# Altium project dmx_duino.PrjPcb
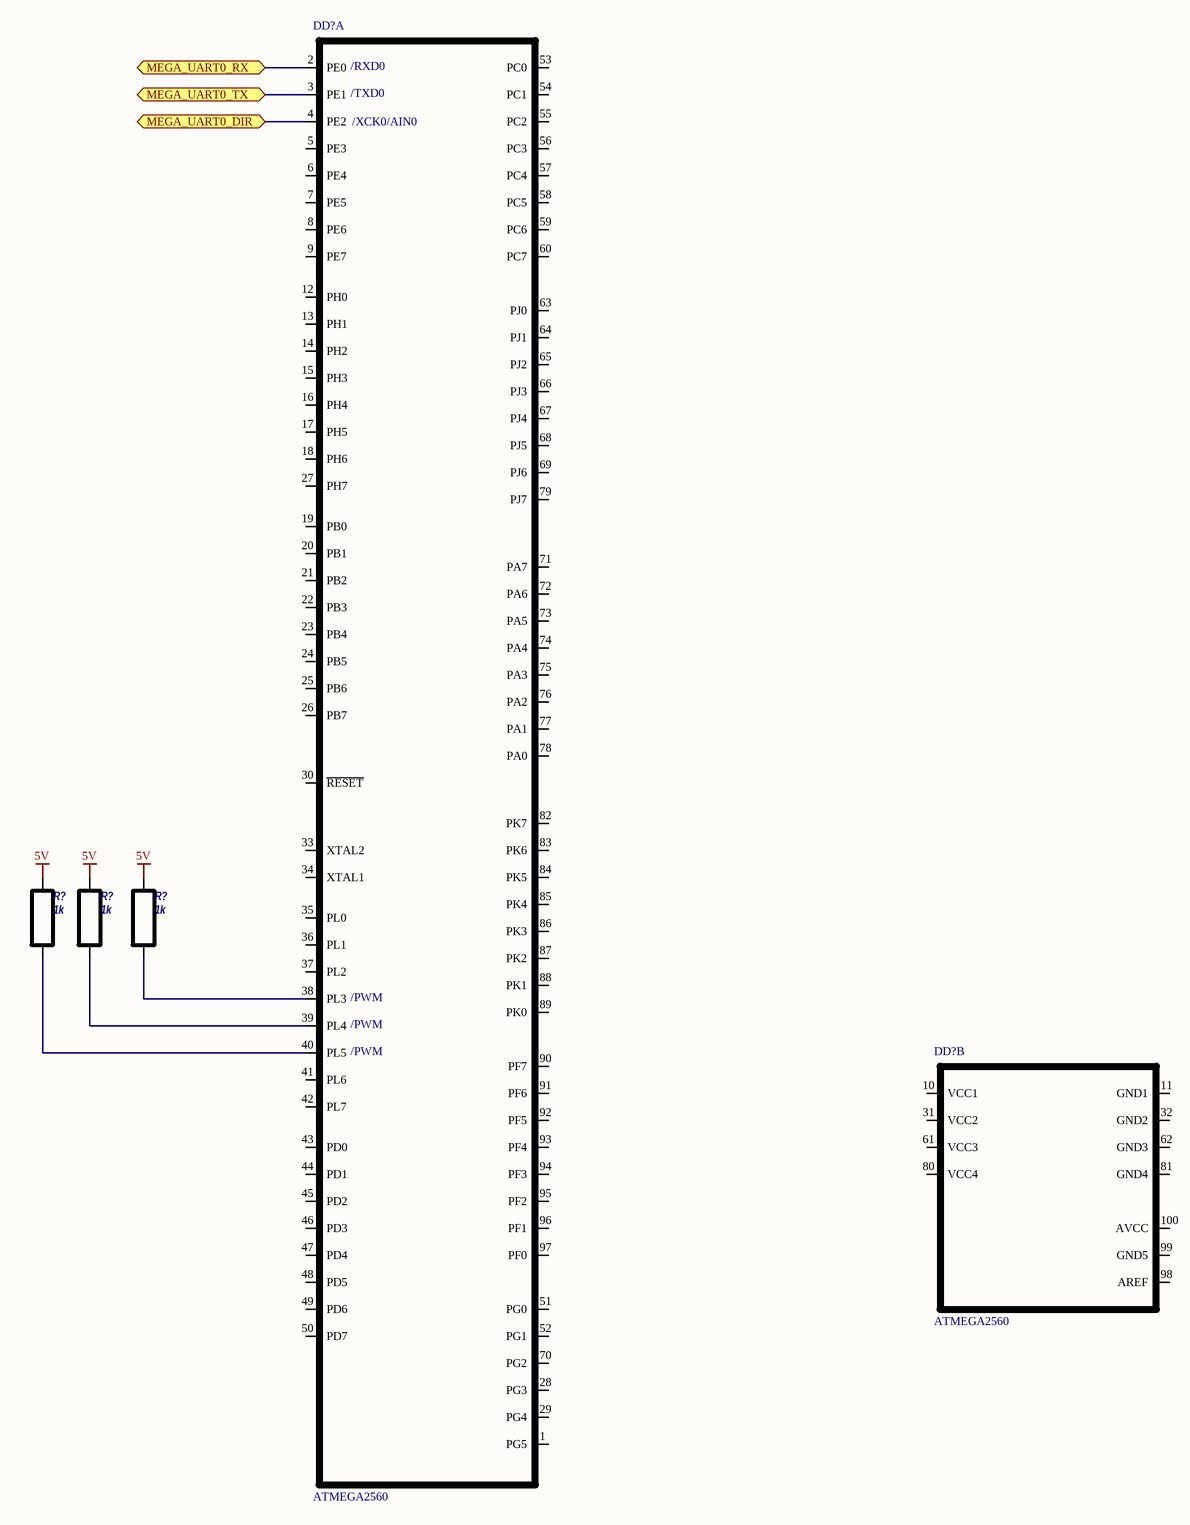
[diagram p0: atmega2560.SchDoc]
7 sheets, 112 parts. Net scope: hierarchical (ports join the sheet entries above them; power ports are global).
Sheets:
  atmega2560.SchDoc
  dmx_interface.SchDoc
  dmx_duino.SchDoc
    U_power = power.SchDoc
    U_STM32F105RBT6 = STM32F105RBT6.SchDoc
  PWM_outputs.SchDoc
  wh1602_buttons_and_encoder.SchDoc

## Sheet atmega2560.SchDoc
size A2

### Parts
(Parts that share a designator on the sheet are numbered #1, #2 ... from top to bottom, then left to right.)
DD?#1  ATMEGA2560  [TQFP100]  (part A of 2)
DD?#2  ATMEGA2560  [TQFP100]  (part B of 2)
R?#1  1k  [R0805]
R?#2  1k  [R0805]
R?#3  1k  [R0805]

### Ports
MEGA_UART0_DIR, MEGA_UART0_RX, MEGA_UART0_TX

### Nets
5V: R?#1.2 R?#2.2 R?#3.2
NetDD?#1_2: DD?#1.2(PE0) ; port MEGA_UART0_RX
NetDD?#1_3: DD?#1.3(PE1) ; port MEGA_UART0_TX
NetDD?#1_4: DD?#1.4(PE2) ; port MEGA_UART0_DIR
NetDD?#1_38: DD?#1.38(PL3) R?#3.1
NetDD?#1_39: DD?#1.39(PL4) R?#2.1
NetDD?#1_40: DD?#1.40(PL5) R?#1.1

Not connected (* = marked no-connect by the designer): DD?#1 1(PG5) 5(PE3) 6(PE4) 7(PE5) 8(PE6) 9(PE7) 12(PH0) 13(PH1) 14(PH2) 15(PH3) 16(PH4) 17(PH5) 18(PH6) 19(PB0) 20(PB1) 21(PB2) 22(PB3) 23(PB4) 24(PB5) 25(PB6) 26(PB7) 27(PH7) 28(PG3) 29(PG4) 30(~{RESET}) 33(XTAL2) 34(XTAL1) 35(PL0) 36(PL1) 37(PL2) 41(PL6) 42(PL7) 43(PD0) 44(PD1) 45(PD2) 46(PD3) 47(PD4) 48(PD5) 49(PD6) 50(PD7) 51(PG0) 52(PG1) 53(PC0) 54(PC1) 55(PC2) 56(PC3) 57(PC4) 58(PC5) 59(PC6) 60(PC7) 63(PJ0) 64(PJ1) 65(PJ2) 66(PJ3) 67(PJ4) 68(PJ5) 69(PJ6) 70(PG2) 71(PA7) 72(PA6) 73(PA5) 74(PA4) 75(PA3) 76(PA2) 77(PA1) 78(PA0) 79(PJ7) 82(PK7) 83(PK6) 84(PK5) 85(PK4) 86(PK3) 87(PK2) 88(PK1) 89(PK0) 90(PF7) 91(PF6) 92(PF5) 93(PF4) 94(PF3) 95(PF2) 96(PF1) 97(PF0); DD?#2 10(VCC1) 11(GND1) 31(VCC2) 32(GND2) 61(VCC3) 62(GND3) 80(VCC4) 81(GND4) 98(AREF) 99(GND5) 100(AVCC)

### Notes on the sheet
- (near DD?#1) /TXD0
- (near DD?#1) /RXD0
- (near DD?#1) /XCK0/AIN0
- (near DD?#1) /PWM

### Library data of the parts
DD?#1 DD?#2 = ATMEGA2560: Atmega2560 - TQFP100; Velue: *
R?#1-R?#3 = R: SMD resistor; Value: 1k

## Sheet dmx_interface.SchDoc
size A3
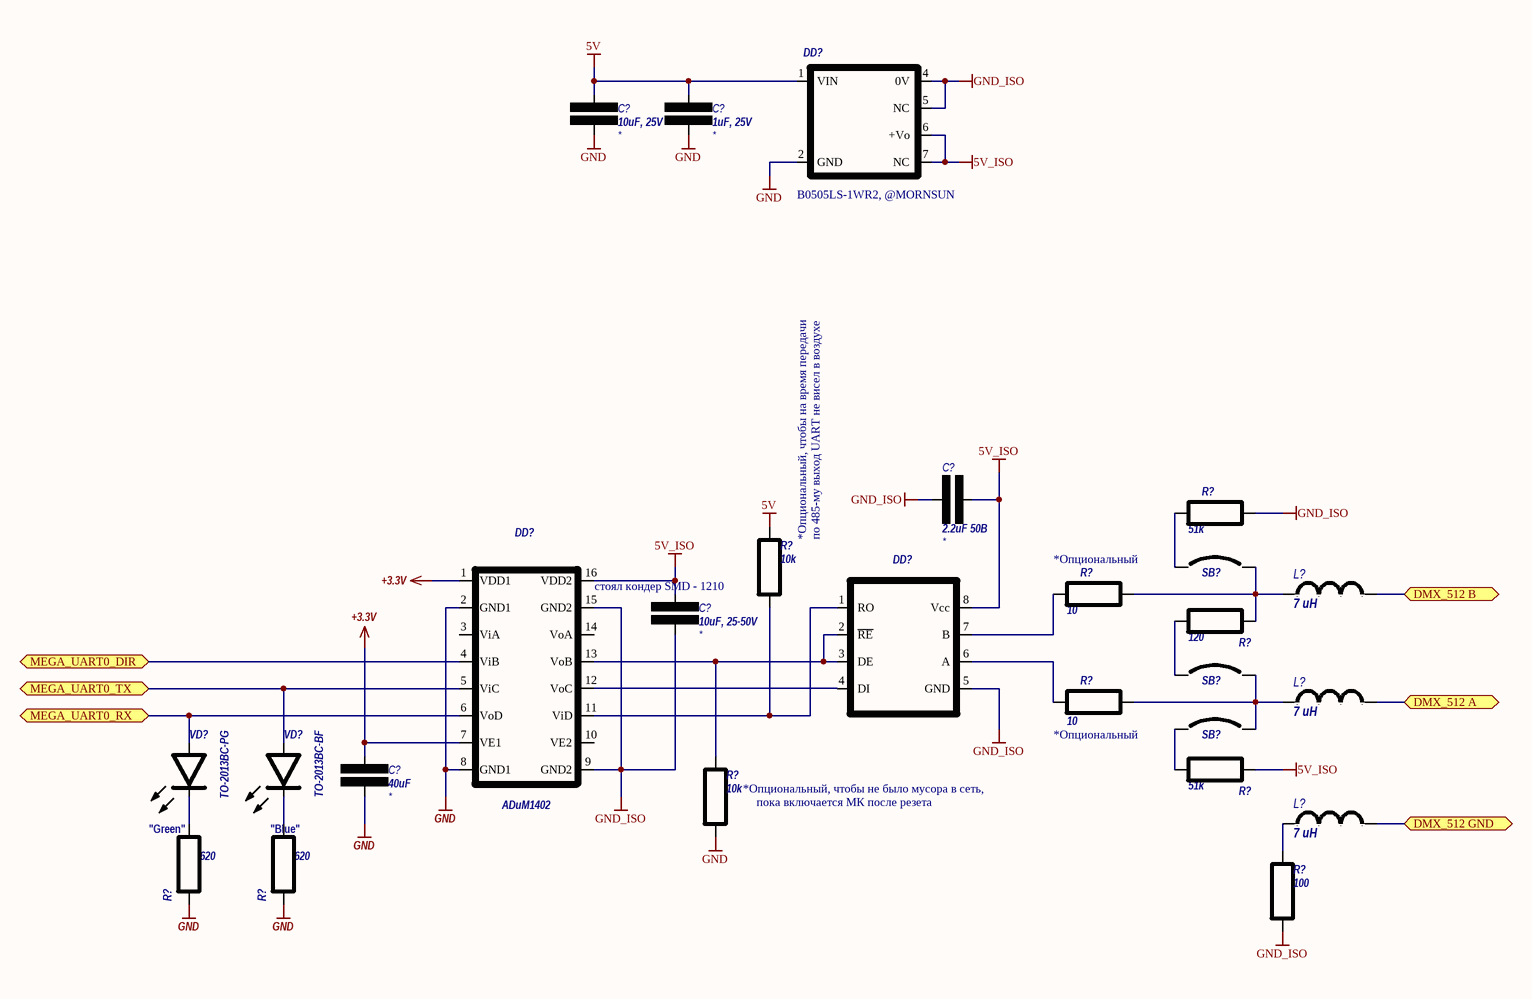
[diagram p1: dmx_interface.SchDoc]

### Parts
(Parts that share a designator on the sheet are numbered #1, #2 ... from top to bottom, then left to right.)
C?#1  10uF, 25V  [C1210]
C?#2  1uF, 25V  [C0805]
C?#3  2.2uF 50В  [C0805]
C?#4  10uF, 25-50V  [C1210]
C?#5  40uF  [C0805]
DD?#3  type: B0505LS-1WR2, @MORNSUN  [0505LS-ISO_POWER]  (hidden comment: B0505LS)
DD?#4  ADuM1402  [SOIC-16W]
DD?#5  ADM485  [DIP8_SMD]  (value not drawn)
L?#1  7 uH  [R0603]
L?#2  7 uH  [R0603]
L?#3  7 uH  [R0603]
R?#4  51k  [R0603]
R?#5  10k  [R0603]
R?#6  10  [R0603]
R?#7  120  [R0603]
R?#8  10  [R0603]
R?#9  51k  [R0603]
R?#10  10k  [R0603]
R?#11  100  [R0603]
R?#12  620  [R0805]
R?#13  620  [R0805]
SB?#1  SB  [SB0603]  (value not drawn)
SB?#2  SB  [SB0603]  (value not drawn)
SB?#3  SB  [SB0603]  (value not drawn)
VD?#1  value TO-2013BC-PG  [led0805]  (hidden comment: LED_0805)
VD?#2  value TO-2013BC-BF  [led0805]  (hidden comment: LED_0805)

### Ports
DMX_512 A, DMX_512 B, DMX_512 GND, MEGA_UART0_DIR, MEGA_UART0_RX, MEGA_UART0_TX

### Nets
5V: C?#1.2 C?#2.2 DD?#3.1(VIN) R?#5.1
5V_ISO: C?#3.2 C?#4.2 DD?#3.6(+Vo) DD?#3.7(NC) DD?#4.16(VDD2) DD?#5.8(Vcc) R?#9.1
+3.3V: C?#5.2 DD?#4.1(VDD1) DD?#4.7(VE1)
GND: C?#1.1 C?#2.1 C?#5.1 DD?#3.2(GND) DD?#4.2(GND1) DD?#4.8(GND1) R?#10.2 R?#12.1 R?#13.1
GND_ISO: C?#3.1 C?#4.1 DD?#3.4(0V) DD?#3.5(NC) DD?#4.9(GND2) DD?#4.15(GND2) DD?#5.5(GND) R?#4.1 R?#11.2
NetDD?#4_4: DD?#4.4(ViB) ; port MEGA_UART0_DIR
NetDD?#4_5: DD?#4.5(ViC) VD?#2.2(A) ; port MEGA_UART0_TX
NetDD?#4_6: DD?#4.6(VoD) VD?#1.2(A) ; port MEGA_UART0_RX
NetDD?#4_11: DD?#4.11(ViD) DD?#5.1(RO) R?#5.2
NetDD?#4_12: DD?#4.12(VoC) DD?#5.4(DI)
NetDD?#4_13: DD?#4.13(VoB) DD?#5.2(~{RE}) DD?#5.3(DE) R?#10.1
NetDD?#5_6: DD?#5.6(A) R?#8.1
NetDD?#5_7: DD?#5.7(B) R?#6.1
NetL?#1_1: L?#1.1 R?#6.2 R?#7.1 SB?#1.2
NetL?#1_2: L?#1.2 ; port DMX_512 B
NetL?#2_1: L?#2.1 R?#8.2 SB?#2.2 SB?#3.2
NetL?#2_2: L?#2.2 ; port DMX_512 A
NetL?#3_1: L?#3.1 R?#11.1
NetL?#3_2: L?#3.2 ; port DMX_512 GND
NetR?#4_2: R?#4.2 SB?#1.1
NetR?#7_2: R?#7.2 SB?#2.1
NetR?#9_2: R?#9.2 SB?#3.1
NetR?#12_2: R?#12.2 VD?#1.1(K)
NetR?#13_2: R?#13.2 VD?#2.1(K)

Not connected (* = marked no-connect by the designer): DD?#4 3(ViA) 10(VE2) 14(VoA)

### Notes on the sheet
- (near R?#5) *Опциональный, чтобы на время передачи
- (near R?#5) по 485-му выход UART не висел в воздухе
- стоял кондер SMD - 1210
- (near R?#6) *Опциональный
- (near R?#8) *Опциональный
- (near R?#10) *Опциональный, чтобы не было мусора в сеть,
- (near R?#10) пока включается МК после резета
- "Green"
- (near R?#13) "Blue"

### Library data of the parts
C?#1-C?#5 = Capacitor: fab: *
  C?#1: Value: 10uF, 25V
  C?#2: Value: 1uF, 25V
  C?#3: Value: 2.2uF 50В
  C?#4: Value: 10uF, 25-50V
  C?#5: Value: 40uF
DD?#3 = B0505LS: DC/DC isolated converter 1W 200mA
DD?#4 = ADuM1402: Quad-Channel Digital Isolators; Value: *
L?#1-L?#3 = L: Inductor; Code_IEC: 1005; Published: 8-Jun-2000; LatestRevisionDate: 29-May-2009; LatestRevisionNote: IPC-7351 Footprint Added.; PackageReference: 0402-A; Publisher: Altium Limited; PackageDescription: Chip Inductor; Code_JEITA: 0402; Value: 7 uH
R?#4 R?#6-R?#9 R?#12 R?#13 = Resistor_russian: Resistor
  R?#4 R?#9: Value: 51k
  R?#6 R?#8: Value: 10
  R?#7: Value: 120
  R?#12 R?#13: Value: 620
R?#5 R?#10 R?#11 = R: SMD resistor
  R?#5 R?#10: Value: 10k
  R?#11: Value: 100
DD?#5 = ADM485: Value: *

## Sheet dmx_duino.SchDoc
size A2
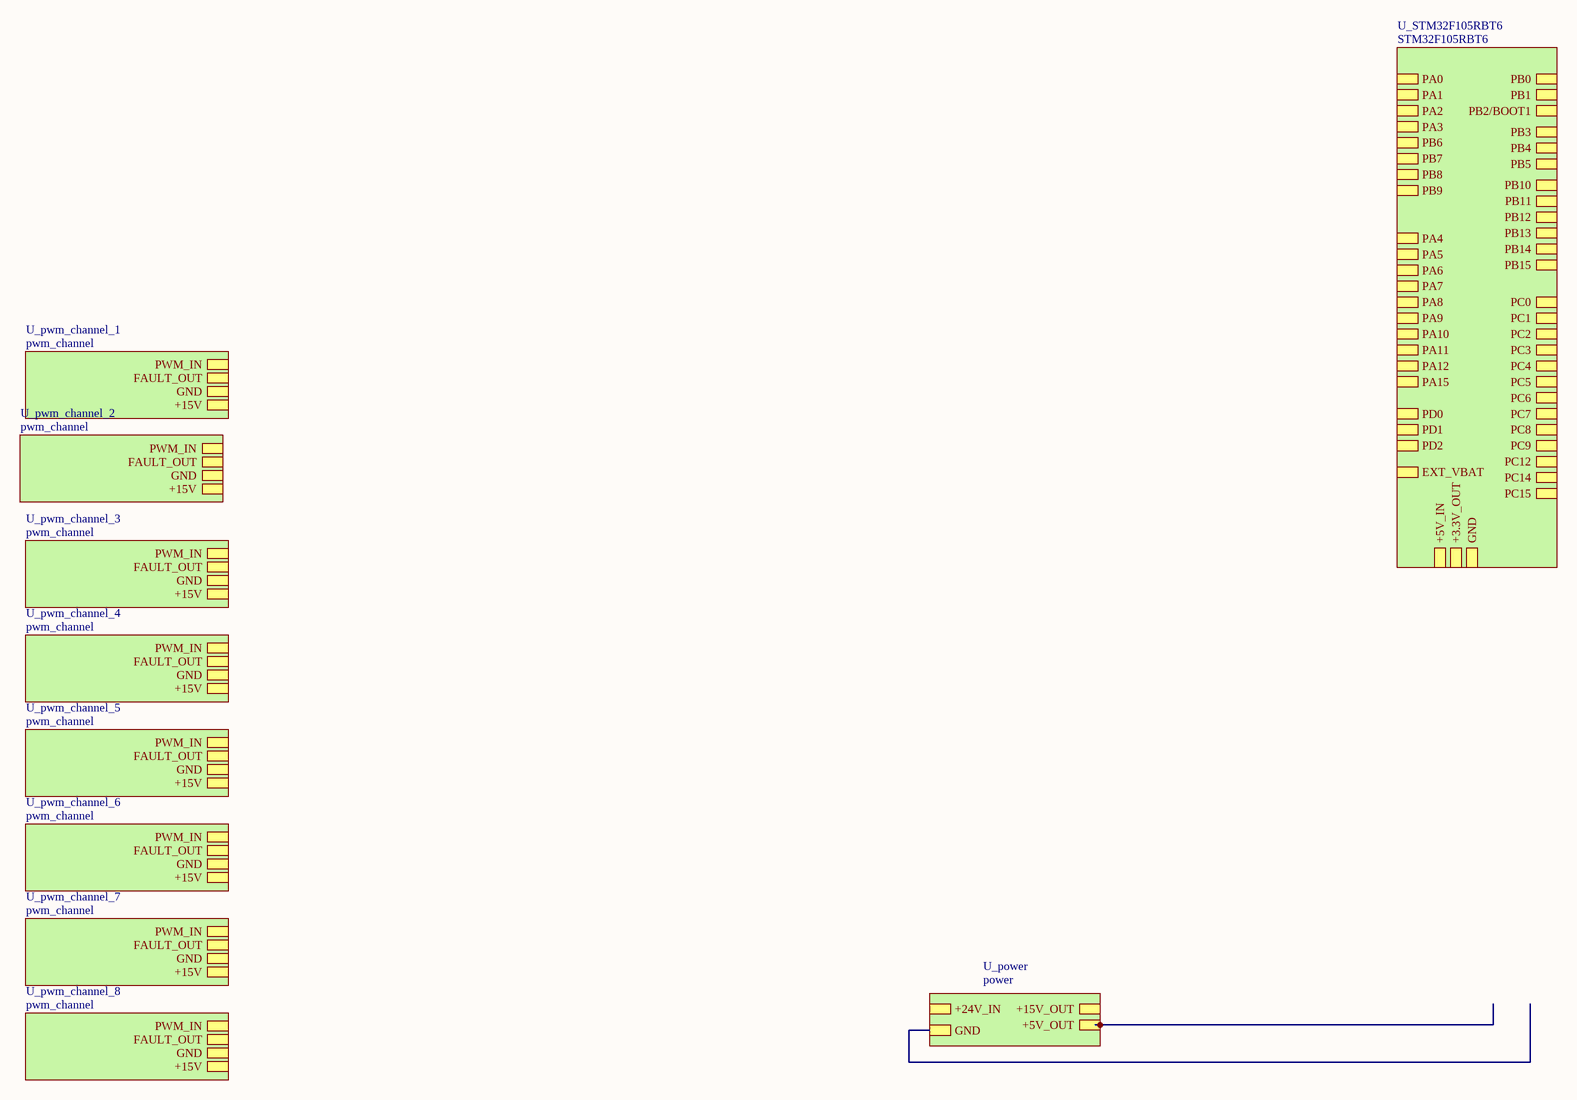
[diagram p2: dmx_duino.SchDoc]

### Sub-sheets
U_power = power: +15V_OUT, +5V_OUT, GND, +24V_IN
U_pwm_channel_1 = pwm_channel (file not in this document): PWM_IN, FAULT_OUT, GND, +15V
U_pwm_channel_2 = pwm_channel (file not in this document): PWM_IN, FAULT_OUT, GND, +15V
U_pwm_channel_3 = pwm_channel (file not in this document): PWM_IN, FAULT_OUT, GND, +15V
U_pwm_channel_4 = pwm_channel (file not in this document): PWM_IN, FAULT_OUT, GND, +15V
U_pwm_channel_5 = pwm_channel (file not in this document): PWM_IN, FAULT_OUT, GND, +15V
U_pwm_channel_6 = pwm_channel (file not in this document): PWM_IN, FAULT_OUT, GND, +15V
U_pwm_channel_7 = pwm_channel (file not in this document): PWM_IN, FAULT_OUT, GND, +15V
U_pwm_channel_8 = pwm_channel (file not in this document): PWM_IN, FAULT_OUT, GND, +15V
U_STM32F105RBT6 = STM32F105RBT6: PC15, PC14, PD0, PD1, PB2/BOOT1, EXT_VBAT, PB3, PB4, PB5, PB6, PB7, PB8, PB9, PB10, PB11, PB12, PB13, PB14, PB15, PC0, PC1, PC2, PC3, PC4, PC5, PC6, PC7, PC8, PC9, PC12, PD2, PB1, PB0, PA0, PA1, PA2, PA3, PA4, PA5, PA6, PA7, PA8, PA9, PA10, PA11, PA12, PA15, +5V_IN, +3.3V_OUT, GND

### Nets
+5V: sheet U_power/+5V_OUT, sheet U_STM32F105RBT6/+5V_IN
GND: sheet U_power/GND, sheet U_STM32F105RBT6/GND

## Sheet power.SchDoc
size A4
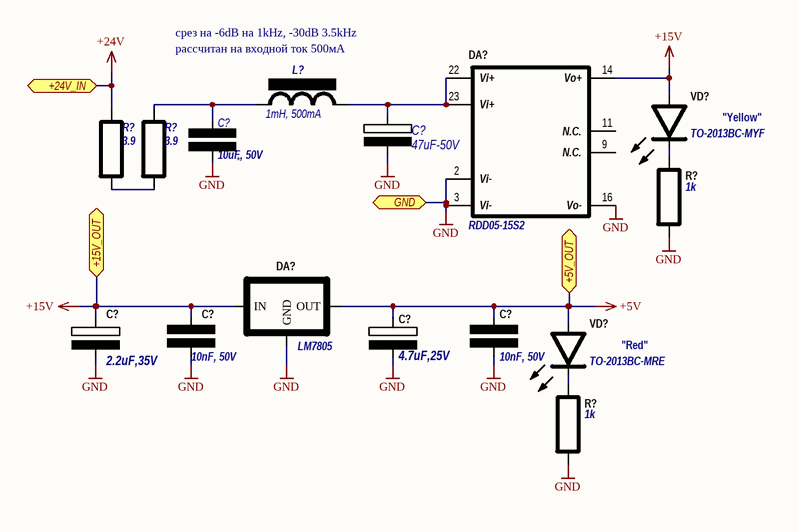
[diagram p3: power.SchDoc]

### Parts
(Parts that share a designator on the sheet are numbered #1, #2 ... from top to bottom, then left to right.)
C?#6  47uF-50V  [Cap_El_6.3x11x2.5_horizontal]
C?#7  10uF, 50V  [C1210]
C?#8  2.2uF,35V  [C2412_CaseC_Tant]
C?#9  4.7uF,25V  [C1411_CaseB_Tant]
C?#10  10nF, 50V  [C0603]
C?#11  10nF, 50V  [C0603]
DA?#1  RDD05-15S2  [FDD03-05S4]
DA?#2  LM7805  [D2PAK_LM7805_D2PAK(Primary)]
L?#4  1mH, 500mA  [L_SMD 1212]
R?#14  3.9  [R2512]
R?#15  3.9  [R2512]
R?#16  1k  [R0805]
R?#17  1k  [R0805]
VD?#3  value TO-2013BC-MYF  [led0805]  (hidden comment: LED_0805)
VD?#4  value TO-2013BC-MRE  [led0805]  (hidden comment: LED_0805)

### Ports
+5V_OUT, +15V_OUT, +24V_IN, GND

### Nets
+5V: C?#9.1(P) C?#11.2 DA?#2.3(OUT) VD?#4.2(A) ; port +5V_OUT
+15V: C?#8.1(P) C?#10.2 DA?#1.14(Vo+) DA?#2.1(IN) VD?#3.2(A) ; port +15V_OUT
+24V: R?#14.2 ; port +24V_IN
GND: C?#6.2 C?#7.1 C?#8.2(M) C?#9.2(M) C?#10.1 C?#11.1 DA?#1.2(Vi-) DA?#1.3(Vi-) DA?#1.16(Vo-) DA?#2.2(GND) R?#16.1 R?#17.1 ; port GND
NetC?#6_1: C?#6.1 DA?#1.22(Vi+) DA?#1.23(Vi+) L?#4.1
NetC?#7_2: C?#7.2 L?#4.2 R?#15.2
NetR?#14_1: R?#14.1 R?#15.1
NetR?#16_2: R?#16.2 VD?#3.1(K)
NetR?#17_2: R?#17.2 VD?#4.1(K)

Not connected (* = marked no-connect by the designer): DA?#1 9(N.C.) 11(N.C.)

### Notes on the sheet
- срез на -6dB на 1kHz, -30dB 3.5kHz
- рассчитан на входной ток 500мА
- (near VD?#3) "Yellow"
- (near VD?#4) "Red"

### Library data of the parts
C?#6 = Capacitor Polar: =Value; fab: *; Value: 47uF-50V
C?#7 C?#10 C?#11 = Capacitor: fab: *
  C?#7: Value: 10uF, 50V
  C?#10 C?#11: Value: 10nF, 50V
C?#8 C?#9 = Capacitor Tantalum: =Value; DEV: CPS_3216_01; FAB: AVX; TEMP: -55°C а 125°C; BOI: A; DESIG: LOW ESR TANTALUM CAPACITOR; TOL: 10%; REF: TPSA106K010R1800
  C?#8: Value: 2.2uF,35V
  C?#9: Value: 4.7uF,25V
DA?#1 = RDD05-15S2: DC - DC CONVERTER  5 ~ 6W SINGLE OUTPUT; man: RDD05-15S2
DA?#2 = LM7805_D2PAK: Value: L7805ABD2T-TR
L?#4 = L_REACTOR: L_AVCC; fab: *; value: 1mH, 500mA
R?#14 R?#15 = R: SMD resistor; Value: 3.9
R?#16 R?#17 = Resistor_russian: Resistor; Value: 1k

## Sheet STM32F105RBT6.SchDoc
size A2
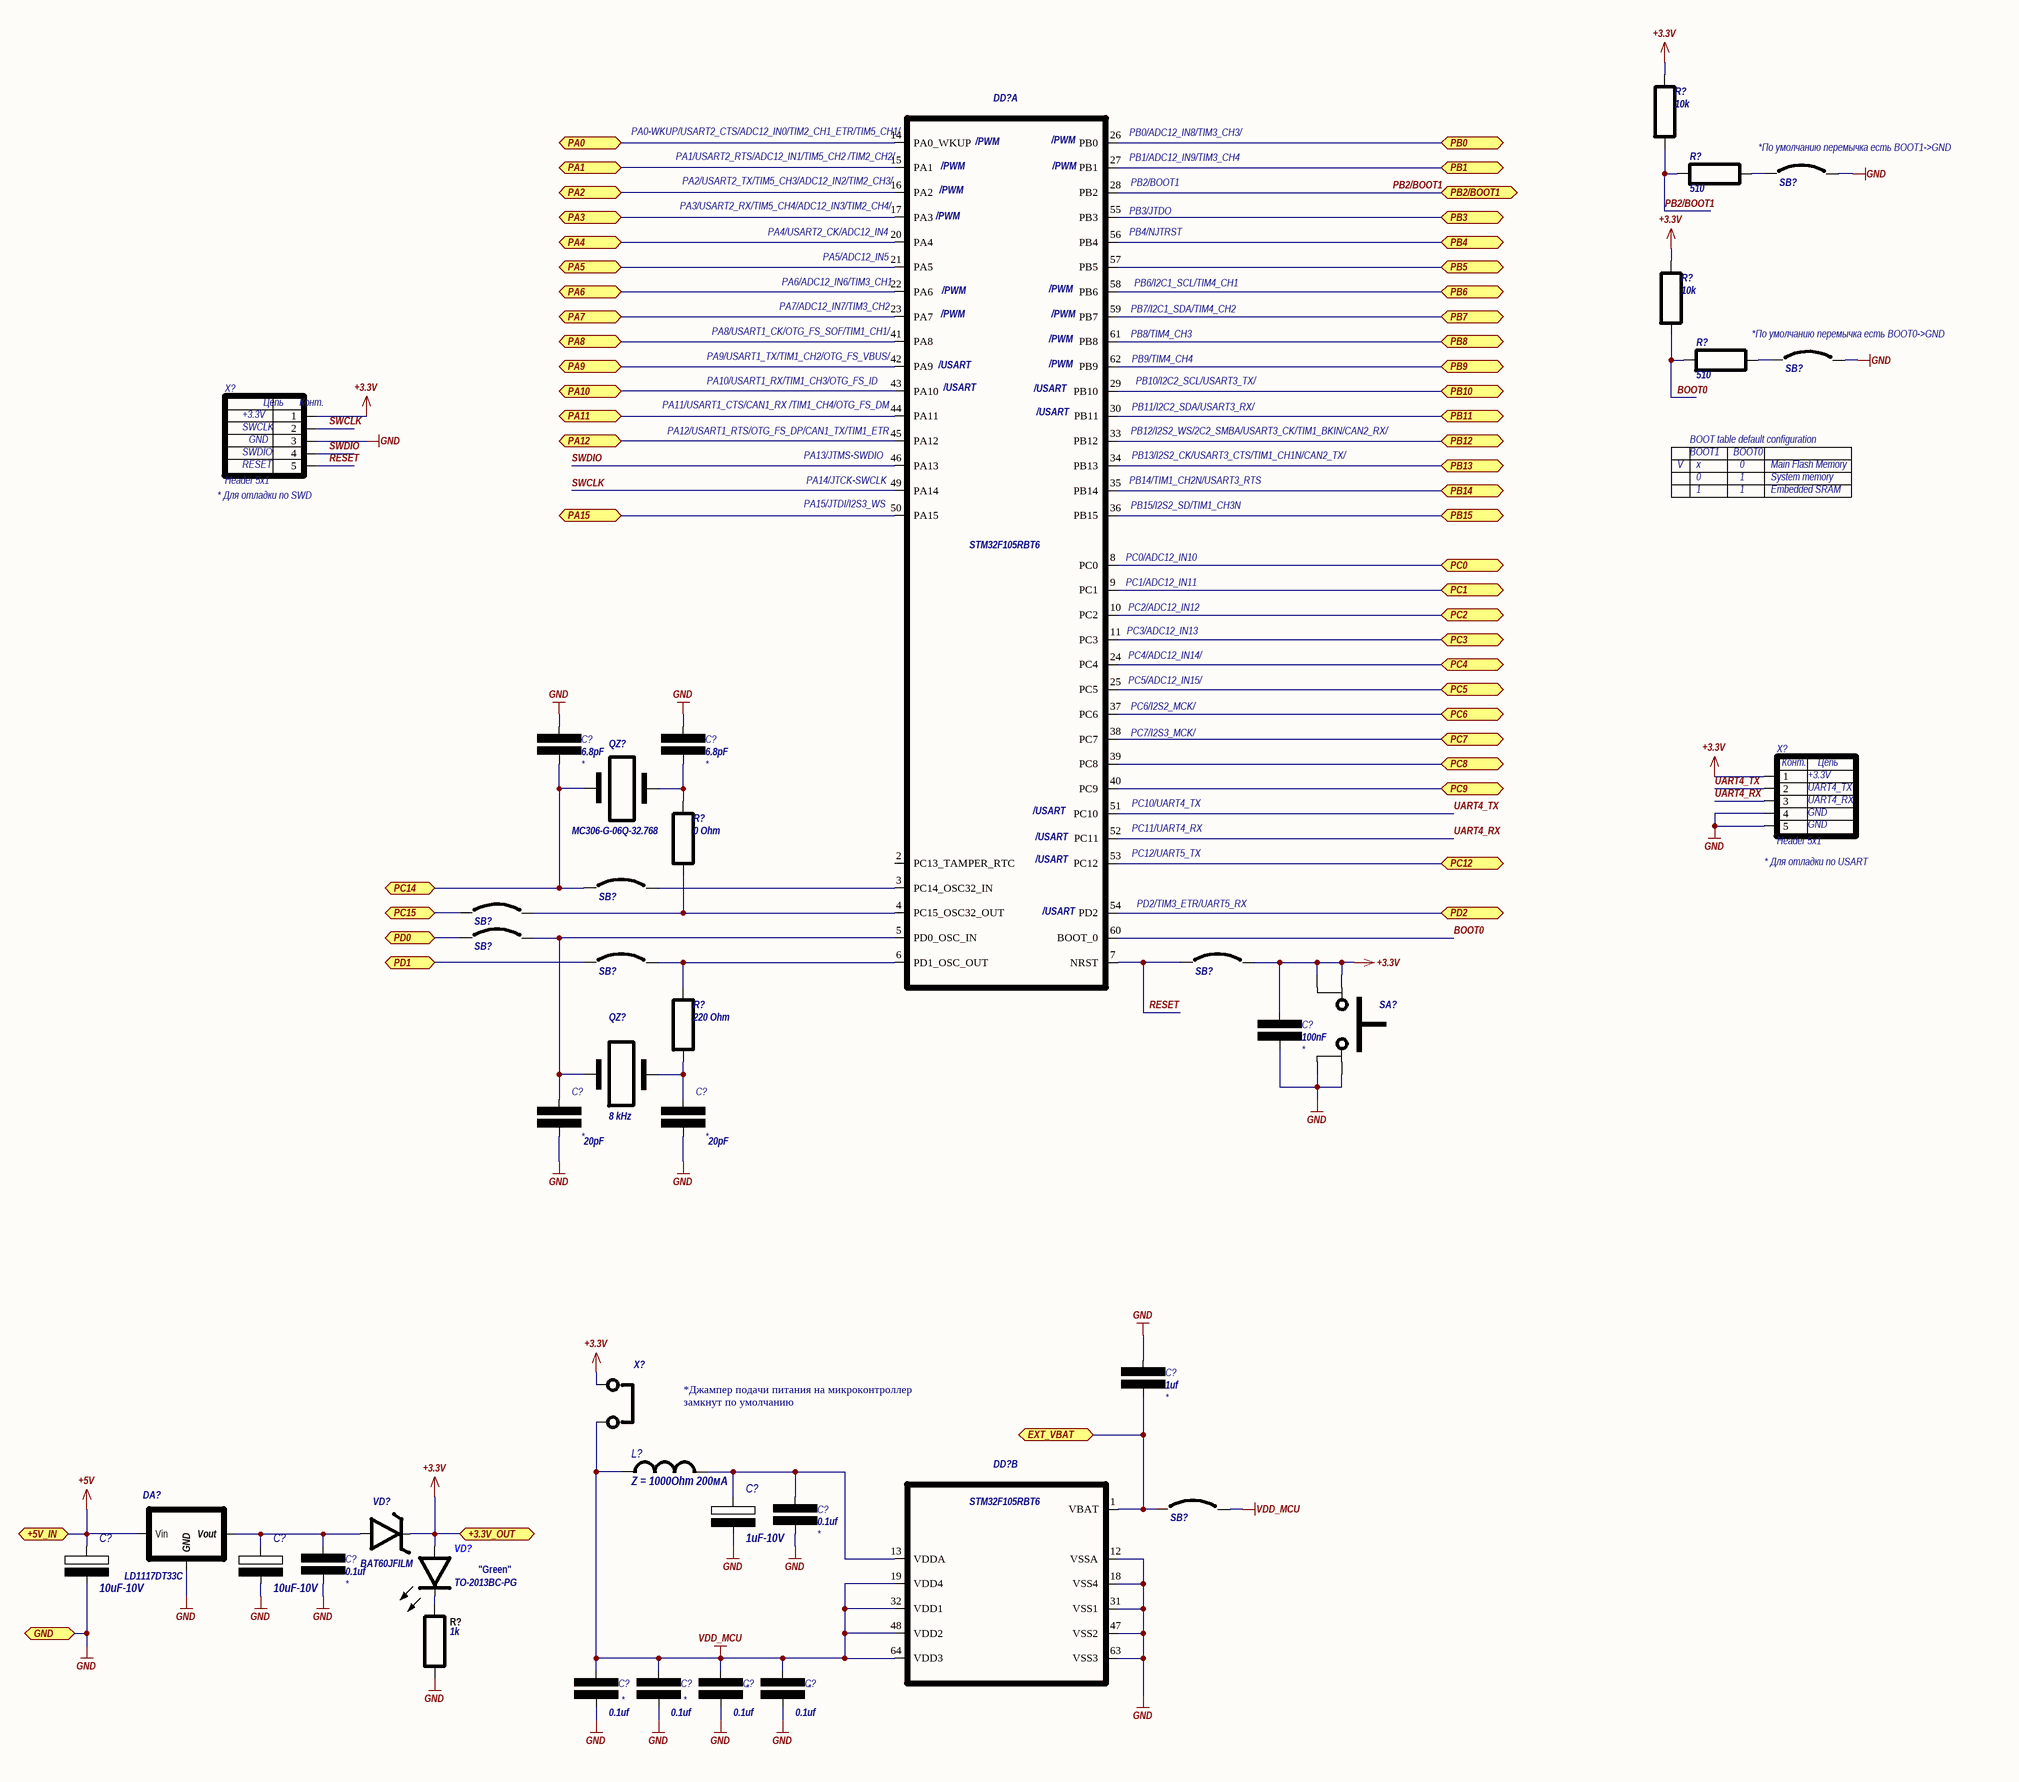
[diagram p4: STM32F105RBT6.SchDoc]

### Parts
(Parts that share a designator on the sheet are numbered #1, #2 ... from top to bottom, then left to right.)
C?#12  6.8pF  [C0603]
C?#13  6.8pF  [C0603]
C?#14  100nF  [C0603]
C?#15  20pF  [C0603]
C?#16  20pF  [C0603]
C?#17  1uf  [C0603]
C?#18  1uF-10V  [C1206_CaseA_Tant]
C?#19  0.1uf  [C0603]
C?#20  10uF-10V  [C1206_CaseA_Tant]
C?#21  10uF-10V  [C1206_CaseA_Tant]
C?#22  0.1uf  [C0603]
C?#23  0.1uf  [C0603]
C?#24  0.1uf  [C0603]
C?#25  0.1uf  [C0603]
C?#26  0.1uf  [C0603]
DA?#3  man: LD1117DT33C  [DPAK]  (hidden comment: LD1117)
DD?#6  STM32F105RBT6  [LQFP64_L]  (part A of 2)
DD?#7  STM32F105RBT6  [LQFP64_L]  (part B of 2)
L?#5  Z = 1000Ohm 200мА  [R0603]
QZ?#1  value MC306-G-06Q-32.768  [MC-306]  (hidden comment: Quarz_32768_4pin)
QZ?#2  value 8 kHz  [HC-49S]  (hidden comment: QARZ_OSCILLATOR)
R?#18  10k  [R0603]
R?#19  510  [R0603]
R?#20  10k  [R0603]
R?#21  510  [R0603]
R?#22  0 Ohm  [R0603]
R?#23  220 Ohm  [R0603]
R?#24  1k  [R0805]
SA?  BUTTON_4PIN_SMD  [BUTTON_SMD_4PIN]  (value not drawn)
SB?#4  SB  [SB0603]  (value not drawn)
SB?#5  SB  [SB0603]  (value not drawn)
SB?#6  SB  [SB0603]  (value not drawn)
SB?#7  SB  [SB0603]  (value not drawn)
SB?#8  SB  [SB0603]  (value not drawn)
SB?#9  SB  [SB0603]  (value not drawn)
SB?#10  SB  [SB0603]  (value not drawn)
SB?#11  SB  [SB0603]  (value not drawn)
VD?#5  BAT60JFILM  [SOD323]
VD?#6  value TO-2013BC-PG  [led0805]  (hidden comment: LED_0805)
X?#1  Header 5x1  [HDR1X5]
X?#2  Header 5x1  [HDR1X5]
X?#3  JUMPER  [JUMPER]  (value not drawn)

### Ports
+3.3V_OUT, +5V_IN, EXT_VBAT, GND, PA0, PA1, PA2, PA3, PA4, PA5, PA6, PA7, PA8, PA9, PA10, PA11, PA12, PA15, PB0, PB1, PB2/BOOT1, PB3, PB4, PB5, PB6, PB7, PB8, PB9, PB10, PB11, PB12, PB13, PB14, PB15, PC0, PC1, PC2, PC3, PC4, PC5, PC6, PC7, PC8, PC9, PC12, PC14, PC15, PD0, PD1, PD2

### Nets
+3.3V: C?#14.2 R?#18.1 R?#20.1 SA?.1 SA?.2 SB?#10.2 VD?#5.2(katode) VD?#6.2(A) X?#1.1 X?#2.1 X?#3.1 ; port +3.3V_OUT
+5V: C?#20.1(P) DA?#3.1(Vin) ; port +5V_IN
GND: C?#12.2 C?#13.2 C?#14.1 C?#15.1 C?#16.1 C?#17.2 C?#18.2(M) C?#19.1 C?#20.2(M) C?#21.2(M) C?#22.1 C?#23.1 C?#24.1 C?#25.1 C?#26.1 DA?#3.2(GND) DD?#7.12(VSSA) DD?#7.18(VSS4) DD?#7.31(VSS1) DD?#7.47(VSS2) DD?#7.63(VSS3) R?#24.1 SA?.3 SA?.4 SB?#4.2 SB?#5.2 X?#1.3 X?#2.4 X?#2.5 ; port GND
VDD_MCU: C?#23.2 C?#24.2 C?#25.2 C?#26.2 DD?#7.19(VDD4) DD?#7.32(VDD1) DD?#7.48(VDD2) DD?#7.64(VDD3) L?#5.1 SB?#11.2 X?#3.2
BOOT0: DD?#6.60(BOOT_0) R?#20.2 R?#21.1
PB2/BOOT1: DD?#6.28(PB2) R?#18.2 R?#19.1 ; port PB2/BOOT1
RESET: DD?#6.7(NRST) SB?#10.1 X?#1.5
SWCLK: DD?#6.49(PA14) X?#1.2
SWDIO: DD?#6.46(PA13) X?#1.4
UART4_RX: DD?#6.52(PC11) X?#2.3
UART4_TX: DD?#6.51(PC10) X?#2.2
NetC?#12_1: C?#12.1 QZ?#1.1(S1) SB?#6.1 ; port PC14
NetC?#13_1: C?#13.1 QZ?#1.4(S4) R?#22.2
NetC?#15_2: C?#15.2 DD?#6.5(PD0_OSC_IN) QZ?#2.1 SB?#8.2
NetC?#16_2: C?#16.2 QZ?#2.2 R?#23.1
NetC?#17_1: C?#17.1 DD?#7.1(VBAT) SB?#11.1 ; port EXT_VBAT
NetC?#18_1: C?#18.1(P) C?#19.2 DD?#7.13(VDDA) L?#5.2
NetC?#21_1: C?#21.1(P) C?#22.2 DA?#3.3(Vout) VD?#5.1(anode)
NetDD?#6_3: DD?#6.3(PC14_OSC32_IN) SB?#6.2
NetDD?#6_4: DD?#6.4(PC15_OSC32_OUT) R?#22.1 SB?#7.2
NetDD?#6_6: DD?#6.6(PD1_OSC_OUT) R?#23.2 SB?#9.2
NetDD?#6_8: DD?#6.8(PC0) ; port PC0
NetDD?#6_9: DD?#6.9(PC1) ; port PC1
NetDD?#6_10: DD?#6.10(PC2) ; port PC2
NetDD?#6_11: DD?#6.11(PC3) ; port PC3
NetDD?#6_14: DD?#6.14(PA0_WKUP) ; port PA0
NetDD?#6_15: DD?#6.15(PA1) ; port PA1
NetDD?#6_16: DD?#6.16(PA2) ; port PA2
NetDD?#6_17: DD?#6.17(PA3) ; port PA3
NetDD?#6_20: DD?#6.20(PA4) ; port PA4
NetDD?#6_21: DD?#6.21(PA5) ; port PA5
NetDD?#6_22: DD?#6.22(PA6) ; port PA6
NetDD?#6_23: DD?#6.23(PA7) ; port PA7
NetDD?#6_24: DD?#6.24(PC4) ; port PC4
NetDD?#6_25: DD?#6.25(PC5) ; port PC5
NetDD?#6_26: DD?#6.26(PB0) ; port PB0
NetDD?#6_27: DD?#6.27(PB1) ; port PB1
NetDD?#6_29: DD?#6.29(PB10) ; port PB10
NetDD?#6_30: DD?#6.30(PB11) ; port PB11
NetDD?#6_33: DD?#6.33(PB12) ; port PB12
NetDD?#6_34: DD?#6.34(PB13) ; port PB13
NetDD?#6_35: DD?#6.35(PB14) ; port PB14
NetDD?#6_36: DD?#6.36(PB15) ; port PB15
NetDD?#6_37: DD?#6.37(PC6) ; port PC6
NetDD?#6_38: DD?#6.38(PC7) ; port PC7
NetDD?#6_39: DD?#6.39(PC8) ; port PC8
NetDD?#6_40: DD?#6.40(PC9) ; port PC9
NetDD?#6_41: DD?#6.41(PA8) ; port PA8
NetDD?#6_42: DD?#6.42(PA9) ; port PA9
NetDD?#6_43: DD?#6.43(PA10) ; port PA10
NetDD?#6_44: DD?#6.44(PA11) ; port PA11
NetDD?#6_45: DD?#6.45(PA12) ; port PA12
NetDD?#6_50: DD?#6.50(PA15) ; port PA15
NetDD?#6_53: DD?#6.53(PC12) ; port PC12
NetDD?#6_54: DD?#6.54(PD2) ; port PD2
NetDD?#6_55: DD?#6.55(PB3) ; port PB3
NetDD?#6_56: DD?#6.56(PB4) ; port PB4
NetDD?#6_57: DD?#6.57(PB5) ; port PB5
NetDD?#6_58: DD?#6.58(PB6) ; port PB6
NetDD?#6_59: DD?#6.59(PB7) ; port PB7
NetDD?#6_61: DD?#6.61(PB8) ; port PB8
NetDD?#6_62: DD?#6.62(PB9) ; port PB9
NetR?#19_2: R?#19.2 SB?#4.1
NetR?#21_2: R?#21.2 SB?#5.1
NetR?#24_2: R?#24.2 VD?#6.1(K)
NetSB?#7_1: SB?#7.1 ; port PC15
NetSB?#8_1: SB?#8.1 ; port PD0
NetSB?#9_1: SB?#9.1 ; port PD1

Not connected (* = marked no-connect by the designer): DD?#6 2(PC13_TAMPER_RTC); QZ?#1 3(S3)

### Notes on the sheet
- (near DD?#6) PA0-WKUP/USART2_CTS/ADC12_IN0/TIM2_CH1_ETR/TIM5_CH1/
- (near DD?#6) PA1/USART2_RTS/ADC12_IN1/TIM5_CH2 /TIM2_CH2/
- (near DD?#6) PA2/USART2_TX/TIM5_CH3/ADC12_IN2/TIM2_CH3/
- (near DD?#6) /PWM
- (near DD?#6) PB0/ADC12_IN8/TIM3_CH3/
- (near DD?#6) PB1/ADC12_IN9/TIM3_CH4
- (near DD?#6) PB2/BOOT1
- *По умолчанию перемычка есть BOOT1->GND
- (near DD?#6) PA3/USART2_RX/TIM5_CH4/ADC12_IN3/TIM2_CH4/
- (near DD?#6) PA4/USART2_CK/ADC12_IN4
- (near DD?#6) PB3/JTDO
- (near DD?#6) PB4/NJTRST
- (near DD?#6) PA7/ADC12_IN7/TIM3_CH2
- (near DD?#6) PA6/ADC12_IN6/TIM3_CH1
- (near DD?#6) PA5/ADC12_IN5
- (near DD?#6) PB7/I2C1_SDA/TIM4_CH2
- (near DD?#6) PB6/I2C1_SCL/TIM4_CH1
- (near DD?#6) PA9/USART1_TX/TIM1_CH2/OTG_FS_VBUS/
- (near DD?#6) PA8/USART1_CK/OTG_FS_SOF/TIM1_CH1/
- (near DD?#6) /USART
- (near DD?#6) PB8/TIM4_CH3
- (near DD?#6) PB9/TIM4_CH4
- *По умолчанию перемычка есть BOOT0->GND
- (near X?#1) +3.3V
- (near X?#1) SWCLK
- (near X?#1) GND
- (near DD?#6) PA11/USART1_CTS/CAN1_RX /TIM1_CH4/OTG_FS_DM
- (near DD?#6) PA12/USART1_RTS/OTG_FS_DP/CAN1_TX/TIM1_ETR
- (near DD?#6) PA10/USART1_RX/TIM1_CH3/OTG_FS_ID
- (near DD?#6) PB12/I2S2_WS/2C2_SMBA/USART3_CK/TIM1_BKIN/CAN2_RX/
- (near DD?#6) PB11/I2C2_SDA/USART3_RX/
- (near DD?#6) PB10/I2C2_SCL/USART3_TX/
- BOOT table default configuration
- (near X?#1) * Для отладки по SWD
- (near X?#1) SWDIO
- (near X?#1) RESET
- (near DD?#6) PA13/JTMS-SWDIO
- (near DD?#6) PA14/JTCK-SWCLK
- (near DD?#6) PB14/TIM1_CH2N/USART3_RTS
- (near DD?#6) PB13/I2S2_CK/USART3_CTS/TIM1_CH1N/CAN2_TX/
- V
- BOOT1
- x
- 0
- 1
- BOOT0
- Main Flash Memory
- System memory
- Embedded SRAM
- (near DD?#6) PA15/JTDI/I2S3_WS
- (near DD?#6) PC0/ADC12_IN10
- (near DD?#6) PB15/I2S2_SD/TIM1_CH3N
- (near DD?#6) PC1/ADC12_IN11
- (near DD?#6) PC2/ADC12_IN12
- (near DD?#6) PC3/ADC12_IN13
- (near DD?#6) PC4/ADC12_IN14/
- (near DD?#6) PC5/ADC12_IN15/
- (near DD?#6) PC6/I2S2_MCK/
- (near DD?#6) PC7/I2S3_MCK/
- (near DD?#6) PC10/UART4_TX
- (near X?#2) +3.3V
- (near X?#2) GND
- (near X?#2) UART4_TX
- (near X?#2) UART4_RX
- (near DD?#6) PC11/UART4_RX
- (near DD?#6) PC12/UART5_TX
- (near X?#2) * Для отладки по USART
- (near DD?#6) PD2/TIM3_ETR/UART5_RX
- *Джампер подачи питания на микроконтроллер
- замкнут по умолчанию
- (near VD?#6) "Green"
- (in symbol Header 5x1) Цепь; Конт.

### Library data of the parts
C?#12-C?#17 C?#19 C?#22-C?#26 = Capacitor: fab: *
  C?#12 C?#13: Value: 6.8pF
  C?#14: Value: 100nF
  C?#15 C?#16: Value: 20pF
  C?#17: Value: 1uf
  C?#19 C?#22-C?#26: Value: 0.1uf
C?#18 C?#20 C?#21 = Capacitor Tantalum: as C?#8 on sheet power
  C?#18: Value: 1uF-10V
  C?#20 C?#21: Value: 10uF-10V
DD?#6 DD?#7 = STM32F105RBT6: Connectivity line, ARM®-based 32-bit MCU with 128 KB Flash, USB  OTG, 10 timers, 2 CANs, 2 ADCs, 14 communication interfaces; Value: *
L?#5 = L: Inductor; Code_IEC: 1005; Published: 8-Jun-2000; LatestRevisionDate: 29-May-2009; LatestRevisionNote: IPC-7351 Footprint Added.; PackageReference: 0402-A; Publisher: Altium Limited; PackageDescription: Chip Inductor; Code_JEITA: 0402; Value: Z = 1000Ohm 200мА
QZ?#1 = Quarz_32768_4pin: QZ_32768HZ
R?#18-R?#23 = R: SMD resistor
  R?#18 R?#20: Value: 10k
  R?#19 R?#21: Value: 510
  R?#22: Value: 0 Ohm
  R?#23: Value: 220 Ohm
R?#24 = Resistor_russian: Resistor; Value: 1k
VD?#5 = BAT60J: SMALL SIGNAL SCHOTTKY DIODE  10V 3A; Value: {Value}
SA? = BUTTON_4PIN_SMD: Value: *
X?#3 = JUMPER: Value: *

## Sheet PWM_outputs.SchDoc
size A4
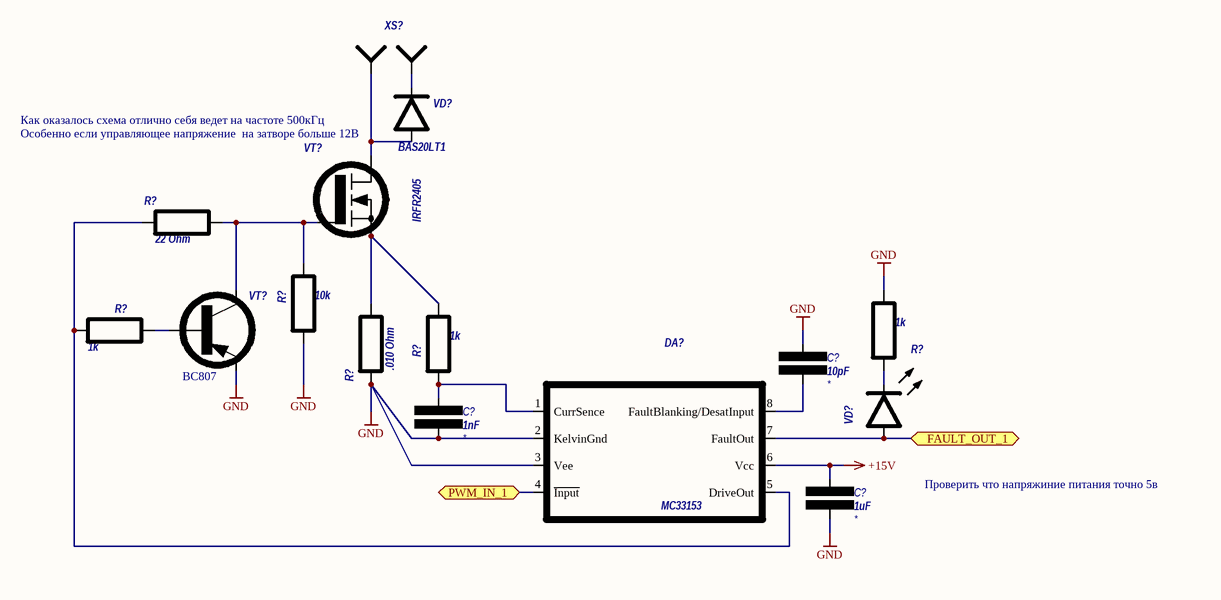
[diagram p5: PWM_outputs.SchDoc]

### Parts
(Parts that share a designator on the sheet are numbered #1, #2 ... from top to bottom, then left to right.)
C?#27  10pF  [C0805]
C?#28  1nF  [C0805]
C?#29  1uF  [C0805]
DA?#4  MC33153  [SOIC-8]
R?#25  22 Ohm  [R0805]
R?#26  1k  [R0603]
R?#27  1k  [R0603]
R?#28  10k  [R0603]
R?#29  1k  [R0603]
R?#30  .010 Ohm  [R2512]
VD?#7  BAS20LT1  [SOT23]
VD?#8  LED_0805  [led0805]  (value not drawn)
VT?#1  IRFR2405  [DPAK]
VT?#2  BC807  [SOT23]
XS?  2EDGV_2P  [2EDGV_2P]  (value not drawn)

### Ports
FAULT_OUT_1, PWM_IN_1

### Nets
+15V: C?#29.2 DA?#4.6(Vcc)
GND: C?#27.2 C?#28.1 C?#29.1 DA?#4.2(KelvinGnd) DA?#4.3(Vee) R?#28.1 R?#29.2 R?#30.1 VT?#2.2(emitter)
NetC?#27_1: C?#27.1 DA?#4.8(FaultBlanking/DesatInput)
NetC?#28_2: C?#28.2 DA?#4.1(CurrSence) R?#26.2
NetDA?#4_4: DA?#4.4(~{Input}) ; port PWM_IN_1
NetDA?#4_5: DA?#4.5(DriveOut) R?#25.1 R?#27.1
NetDA?#4_7: DA?#4.7(FaultOut) VD?#8.2(A) ; port FAULT_OUT_1
NetR?#25_2: R?#25.2 R?#28.2 VT?#1.1(gate) VT?#2.3(collector)
NetR?#26_1: R?#26.1 R?#30.2 VT?#1.2(source)
NetR?#27_2: R?#27.2 VT?#2.1(base)
NetR?#29_1: R?#29.1 VD?#8.1(K)
NetVD?#7_1: VD?#7.1(a) VT?#1.3(drain) XS?.1
NetVD?#7_3: VD?#7.3(k) XS?.2

### Notes on the sheet
- Как оказалось схема отлично себя ведет на частоте 500кГц
- Особенно если управляющее напряжение  на затворе больше 12В
- Проверить что напряжиние питания точно 5в

### Library data of the parts
C?#27-C?#29 = Capacitor: fab: *
  C?#27: Value: 10pF
  C?#28: Value: 1nF
  C?#29: Value: 1uF
DA?#4 = MC33153: IGBT driver for high  power applications; Value: *
R?#25-R?#30 = Resistor_russian: Resistor
  R?#25: Value: 22 Ohm
  R?#26 R?#27 R?#29: Value: 1k
  R?#28: Value: 10k
  R?#30: Value: .010 Ohm
VD?#7 = BAS20LT1: High Voltage  Switching Diode; Value: {Value}
VD?#8 = LED_0805: Value: {Value}
VT?#1 = IRFR2405: Power n-channel MOSFET ,55V,56A,0.016Ohm; Value: IRFR2405
VT?#2 = BC807: Value: {Value}
XS? = 2EDGV_2P: Value: *

## Sheet wh1602_buttons_and_encoder.SchDoc
size A4
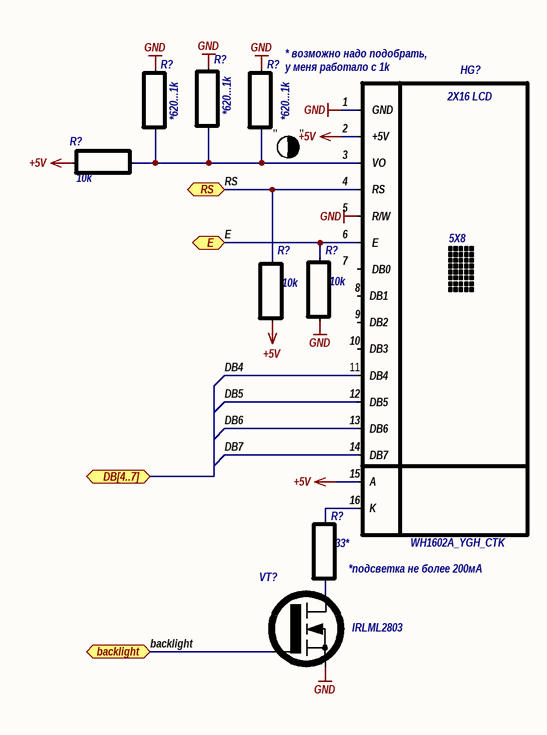
[diagram p6: wh1602_buttons_and_encoder.SchDoc]

### Parts
(Parts that share a designator on the sheet are numbered #1, #2 ... from top to bottom, then left to right.)
HG?  WH1602A_YGH_CTK  [WH1602A_YGH_CTK]
R?#31  *620...1k  [R0402]
R?#32  *620...1k  [R0402]
R?#33  *620...1k  [R0402]
R?#34  10k  [R0402]
R?#35  10k  [R0402]
R?#36  10k  [R0402]
R?#37  33*  [R0805]
VT?#3  IRLML2803  [SOT23]

### Ports
backlight, DB[4..7], E, RS

### Nets
+5V: HG?.2(+5V) HG?.15(A) R?#34.1 R?#35.1
GND: HG?.1(GND) HG?.5(R/W) R?#31.2 R?#32.2 R?#33.2 R?#36.1 VT?#3.2(source)
backlight: VT?#3.1(gate) ; port backlight
DB4: HG?.11(DB4)
DB5: HG?.12(DB5)
DB6: HG?.13(DB6)
DB7: HG?.14(DB7)
E: HG?.6(E) R?#36.2 ; port E
RS: HG?.4(RS) R?#35.2 ; port RS
NetHG?_3: HG?.3(VO) R?#31.1 R?#32.1 R?#33.1 R?#34.2
NetHG?_16: HG?.16(K) R?#37.2
NetR?#37_1: R?#37.1 VT?#3.3(drain)

Not connected (* = marked no-connect by the designer): HG? 7(DB0) 8(DB1) 9(DB2) 10(DB3) A G K

### Notes on the sheet
- (near R?#33) * возможно надо подобрать,
- у меня работало с 1k
- (near R?#33) "
- "
- *подсветка не более 200мА
- (in symbol WH1602A_YGH_CTK) 2X16 LCD; 5X8

### Library data of the parts
R?#31-R?#37 = Resistor_russian: Resistor
  R?#31-R?#33: Value: *620...1k
  R?#34-R?#36: Value: 10k
  R?#37: Value: 33*
VT?#3 = IRLML2803: HEXFET® Power MOSFET; Value: IRLML2803
HG? = WH1602A_YGH_CTK: Value: *

## Nets that join several sheets
5V: atmega2560 (R?#1.2 R?#2.2 R?#3.2), dmx_interface (C?#1.2 C?#2.2 DD?#3.1 R?#5.1)
+3.3V: dmx_interface (C?#5.2 DD?#4.1 DD?#4.7), STM32F105RBT6 (11 pins)
+5V: power (C?#9.1 C?#11.2 DA?#2.3 VD?#4.2), STM32F105RBT6 (C?#20.1 DA?#3.1), wh1602_buttons_and_encoder (HG?.2 HG?.15 R?#34.1 R?#35.1)
+15V: power (5 pins), PWM_outputs (C?#29.2 DA?#4.6)
GND: dmx_interface (9 pins), power (12 pins), STM32F105RBT6 (29 pins), PWM_outputs (9 pins), wh1602_buttons_and_encoder (7 pins)